# EAGLE design OSO-MISC-21-021 Sensor Watch Motion II (EAGLE 9.6.2)
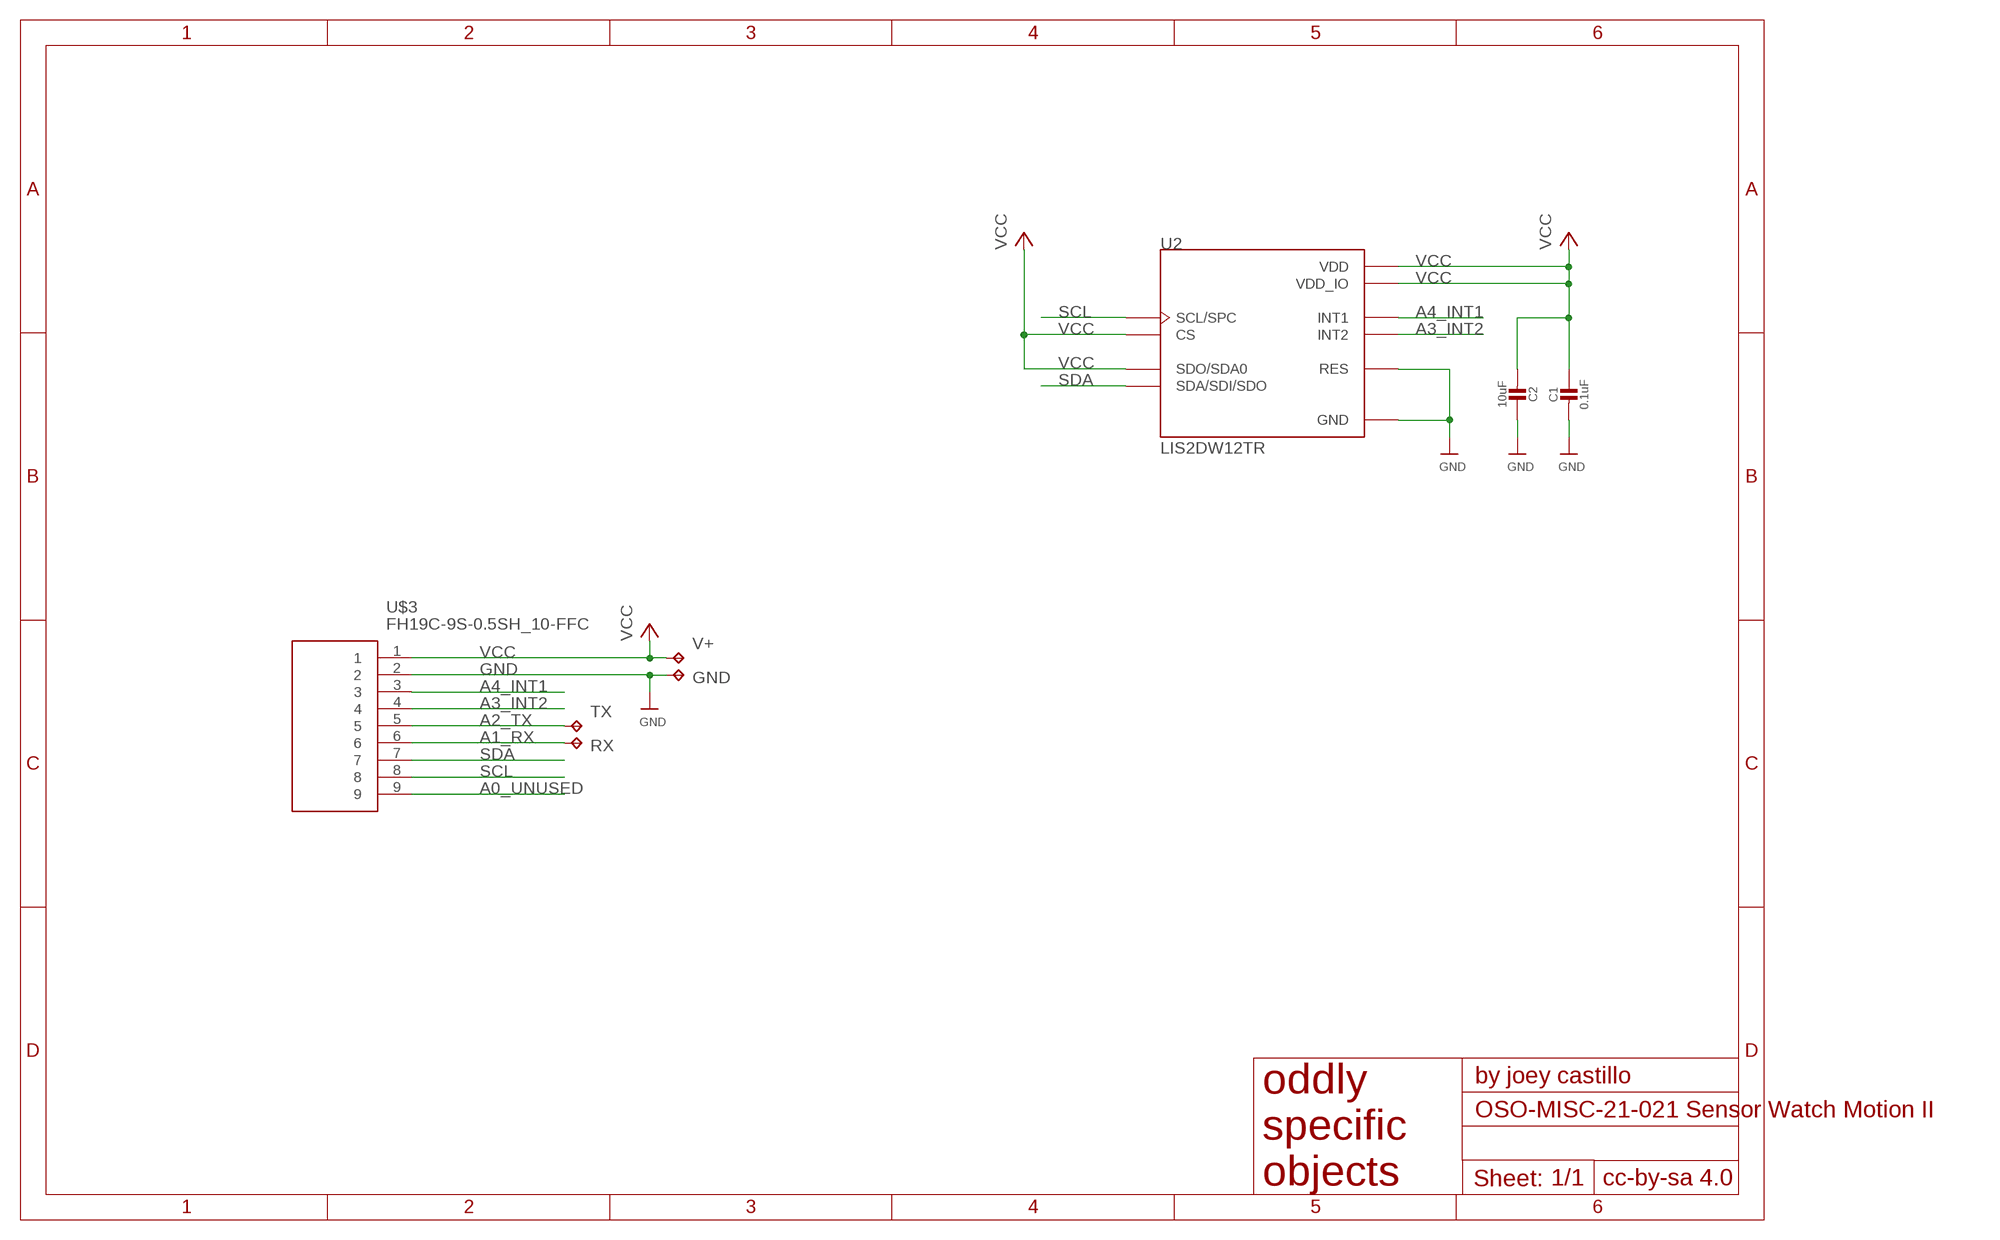
[diagram p0: schematic, sheet 1]

## Parts
C1  0.1uF  CAP_CERAMIC_0603MP  [_0603MP]
C2  10uF  CAP_CERAMIC_0603MP  [_0603MP]
GND  TPB1,27  [B1,27]
RX  TPB1,27  [B1,27]
TX  TPB1,27  [B1,27]
U2  LIS2DW12TR  [LGA12R50P4X4_200X200X70]
U$3  FH19C-9S-0.5SH_10-FFC  [FH19C9S05SH10-FFC]
V+  TPB1,27  [B1,27]

## Nets
A0_UNUSED: U$3.9
A1_RX: RX.TP U$3.6
A2_TX: TX.TP U$3.5
A3_INT2: U2.11(INT2) U$3.4
A4_INT1: U2.12(INT1) U$3.3
GND [gnd]: C1.2 C2.1 GND.TP U2.6(GND) U2.7(RES) U2.8(GND) U$3.2
SCL: U2.1(SCL/SPC) U$3.8
SDA: U2.4(SDA/SDI/SDO) U$3.7
VCC: C1.1 C2.2 U2.2(CS) U2.3(SDO/SDA0) U2.9(VDD) U2.10(VDD_IO) U$3.1 V+.TP

## Library data of the parts
C1 C2 = microbuilder:CAP_CERAMIC: Ceramic Capacitors For new designs, use the packages preceded by an '_' character since they are more reliable: The following footprints should be used on most boards: _0402 - Standard footprint for regular board layouts _0603 - Standard footprint for regular board layouts _0805 - Standard footprint for regular board layouts _1206 - Standard footprint for regular board layouts For extremely tight-pitch boards where space is at a premium, the following 'micro-pitch' footprints can be used (smaller pads, no silkscreen outline, etc.): _0402MP - Micro-pitch footprint for very dense/compact boards _0603MP - Micro-pitch footprint for very dense/compact boards _0805MP - Micro-pitch footprint for very dense/compact boards _1206MP - Micro-pitch footprint for very dense/compact boards
GND RX TX V+ = testpad:TP: Test pad
U2 = LIS2DW12TR:LIS2DW12TR: Mems Digital Output Motion Sensor; DESCRIPTION: Accelerometer X, Y, Z Axis ±2g, 4g, 8g, 16g 400Hz 12-LGA (2x2); MF: STMicroelectronics; MP: LIS2DW12TR; PACKAGE: LGA-12 STMicroelectronics; PURCHASE-URL: https://pricing.snapeda.com/search/part/LIS2DW12TR/?ref=eda
U$3 = FH19C-9S-0.5SH:FH19C-9S-0.5SH_10-FFC

## Net classes
0 default: width 0.152 mm
1 power: width 0.152 mm
2 gnd: width 0.152 mm

## Board
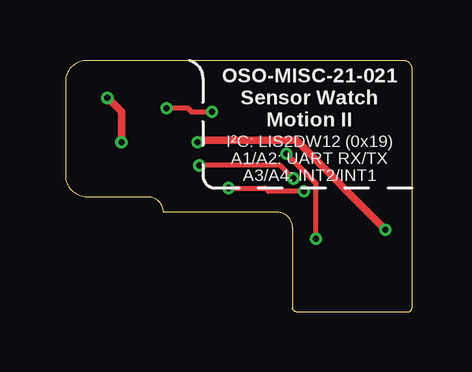
[diagram p1: board, top side]
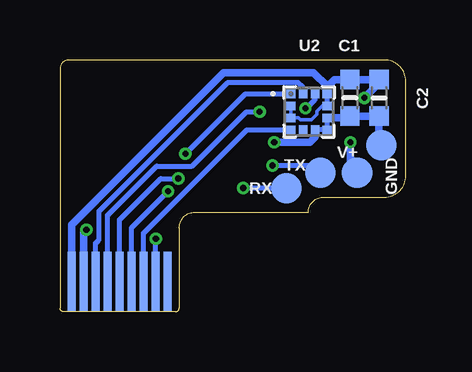
[diagram p2: board, bottom side, seen from below]

Size 14.43 x 10.48 mm. Coordinates in mm from the lower left corner, seen from the top.
Outline: 9.45,3.5 arc90 8.81,4.14 4.06,4.14 arc90 3.43,4.77 0.89,4.77 arc-90 0,5.66 0,9.6 arc-90 0.89,10.48 14.05,10.48 arc-90 14.43,10.1 14.43,3.5
Copper layers (1*16): Top 0.035559375mm / dielectric 1.6mm / Bottom 0.035559375mm
Design rules "oshpark-2layer *": minimum track width 6mil, minimum drill 10mil, track to track 6mil, track to pad 6mil, pad to pad 6mil, via to via 6mil, smd to smd 6mil, copper to edge 15mil, drill to drill 6mil, minimum pad ring 5mil, minimum via ring 5mil, stop-mask expansion 2.5mil, vias tented up to drill 10mil, thermal gap 10mil

### Footprints (pad centres in the part's own frame; a part is rotated, then mirrored left to right if it is on the bottom)
_0603MP = smd 0.8 x 0.8: 1 -0.762,0; 2 0.762,0
B1,27 = smd 1.27 x 1.27: TP 0,0
LGA12R50P4X4_200X200X70 = smd 0.4 x 0.35: 1 -0.76,0.75; 2 -0.76,0.25; 3 -0.76,-0.25; 4 -0.76,-0.75; 7 0.76,-0.75; 8 0.76,-0.25; 9 0.76,0.25; 10 0.76,0.75 | smd 0.35 x 0.4: 5 -0.25,-0.76; 6 0.25,-0.76; 11 0.25,0.76; 12 -0.25,0.76
FH19C9S05SH10-FFC = smd 0.347 x 2.5 bottom: 1 2,-2.25; 2 1.5,-2.25; 3 1,-2.25; 4 0.5,-2.25; 5 0,-2.25; 6 -0.5,-2.25; 7 -1,-2.25; 8 -1.5,-2.25; 9 -2,-2.25

### Placement (x,y rotation side)
C1  2.34,8.91 270 bottom
C2  1.12,8.91 90 bottom
GND  1.02,6.94 0 bottom
RX  4.98,5.15 0 bottom
TX  3.56,5.79 0 bottom
U2  4.04,8.33 0 bottom
U$3  11.94,3.5 0 top
V+  2.03,5.79 0 bottom

### Tracks (layer width: path | path; a pad name or v marks a point on that pad's centre or on a via)
A1_RX  (via drill 0.25)
  Top 0.203: v6.78,5.15 8.31,5.15 8.44,5.01 v9.92,5.01
  Bottom 0.203: U$3.6 11.44,3.5 v9.92,5.01 | RX.TP v6.78,5.15
A2_TX  (via drill 0.25)
  Top 0.203: v9.49,5.55 8.94,6.09 v5.56,6.09
  Bottom 0.203: U$3.5 11.94,3.83 10.23,5.55 v9.49,5.55 | v5.56,6.09 3.86,6.09 TX.TP
A3_INT2  (via drill 0.25)
  Top 0.203: v4.19,8.48 5.08,8.48 5.23,8.33 v6.1,8.33
  Bottom 0.203: U2.11 3.79,8.83 4.14,8.48 v4.19,8.48 | v6.1,8.33 6.66,8.33 8.92,6.07 10.39,6.07 12.44,4.02 U$3.4
A4_INT1
  Bottom 0.203: U$3.3 12.94,2.85 12.81,2.98 12.81,4.17 7.43,9.54 4.49,9.54 4.29,9.34 U2.12
GND  (via drill 0.25)
  Top 0.305: v5.49,7.06 5.57,7.13 9.61,7.13 v13.32,3.41
  Bottom 0.203: U2.8 U2.7 3.78,7.58 U2.6
  Bottom 0.305: U2.6 3.79,7.26 3.99,7.06 v5.49,7.06 | U$3.2 13.44,3.3 v13.32,3.41 | GND.TP 1.12,7.04 C2.1 C1.2 2.41,8.07 U2.8
SCL  (via drill 0.25)
  Top 0.203: v10.43,3.03 10.43,5.34 v9.2,6.57
  Bottom 0.203: U$3.8 10.44,3.02 v10.43,3.03 | v9.2,6.57 6.69,9.08 U2.1
SDA
  Bottom 0.203: U$3.7 10.94,3.27 6.63,7.58 U2.4
VCC  (via drill 0.25)
  Top 0.305: v1.73,8.9 2.31,8.32 v2.31,7.06
  Bottom 0.152: U2.9 3.48,8.58 3.71,8.35 3.71,8.23 3.94,8 4.39,8 4.47,8.08 U2.3 U2.2
  Bottom 0.203: U2.9 U2.10
  Bottom 0.305: V+.TP 2.31,6.07 v2.31,7.06 | v1.73,8.9 1.12,9.51 C2.2 C1.1 2.97,9.67 3.27,9.37 3.28,9.38 | U2.10 3.28,9.38 | 3.28,9.38 3.85,9.95 7.6,9.95 13.94,3.61 U$3.1

### Text on the board
tPlace: OSO-MISC-21-021 / Sensor Watch / Motion II | I²C: LIS2DW12 (0x19) / A1/A2: UART RX/TX / A3/A4: INT2/INT1